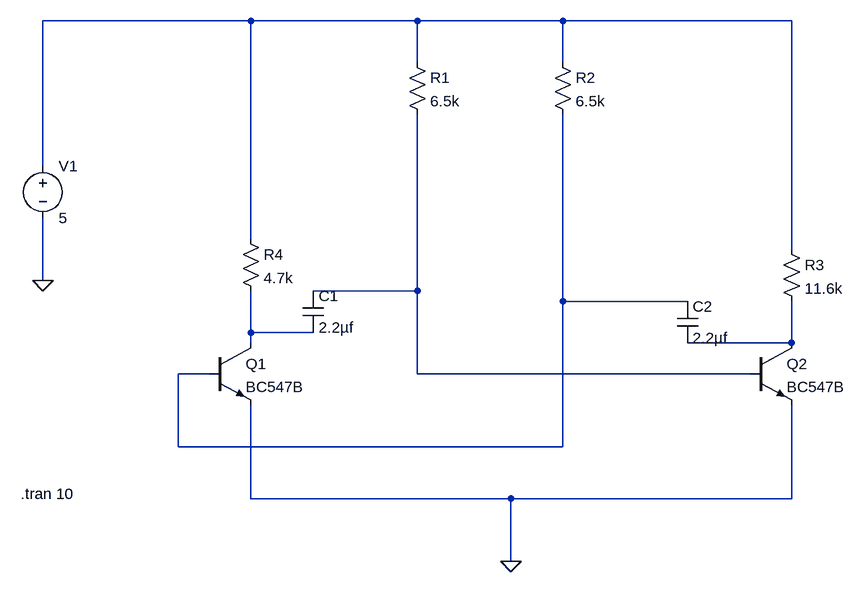
[diagram p0: schematic astable_multivibrator.asc]
astable_multivibrator.asc, the LTspice schematic file:
Version 4
SHEET 1 880 680
WIRE -80 -384 -400 -384
WIRE 176 -384 -80 -384
WIRE 400 -384 176 -384
WIRE 752 -384 400 -384
WIRE 176 -320 176 -384
WIRE 400 -320 400 -384
WIRE -400 -160 -400 -384
WIRE -80 -48 -80 -384
WIRE 752 -32 752 -384
WIRE -400 16 -400 -80
WIRE 176 32 176 -240
WIRE 176 32 16 32
WIRE 400 48 400 -240
WIRE 592 48 400 48
WIRE -80 96 -80 32
WIRE 16 96 -80 96
WIRE -80 112 -80 96
WIRE 752 112 752 48
WIRE 752 112 592 112
WIRE -144 160 -192 160
WIRE 176 160 176 32
WIRE 688 160 176 160
WIRE -192 272 -192 160
WIRE 400 272 400 48
WIRE 400 272 -192 272
WIRE -80 352 -80 208
WIRE 320 352 -80 352
WIRE 752 352 752 208
WIRE 752 352 320 352
WIRE 320 448 320 352
FLAG 320 448 0
FLAG -400 16 0
SYMBOL npn -144 112 R0
SYMATTR InstName Q1
SYMATTR Value BC547B
SYMBOL npn 688 112 R0
SYMATTR InstName Q2
SYMATTR Value BC547B
SYMBOL res 160 -336 R0
SYMATTR InstName R1
SYMATTR Value 6.5k
SYMBOL res 384 -336 R0
SYMATTR InstName R2
SYMATTR Value 6.5k
SYMBOL res 736 -48 R0
SYMATTR InstName R3
SYMATTR Value 11.6k
SYMBOL res -96 -64 R0
SYMATTR InstName R4
SYMATTR Value 4.7k
SYMBOL cap 0 32 R0
SYMATTR InstName C1
SYMATTR Value 2.2µf
SYMBOL cap 576 48 R0
SYMATTR InstName C2
SYMATTR Value 2.2µf
SYMBOL voltage -400 -176 R0
WINDOW 123 0 0 Left 0
WINDOW 39 0 0 Left 0
SYMATTR InstName V1
SYMATTR Value 5
TEXT -434 344 Left 2 !.tran 10

The netlist it stands for:
* astable_multivibrator.asc
Q1 N004 N003 0 0 BC547B
Q2 N005 N002 0 0 BC547B
R1 N001 N002 6.5k
R2 N001 N003 6.5k
R3 N001 N005 11.6k
R4 N001 N004 4.7k
C1 N002 N004 2.2µf
C2 N003 N005 2.2µf
V1 N001 0 5
.model NPN NPN
.model PNP PNP
.lib standard.bjt
.tran 10
.backanno
.end